# Altium schematic sheet LIDO-HW.300.VehicleInterface.SchDoc
size A3; SheetNumber: 14; SheetTotal: 17
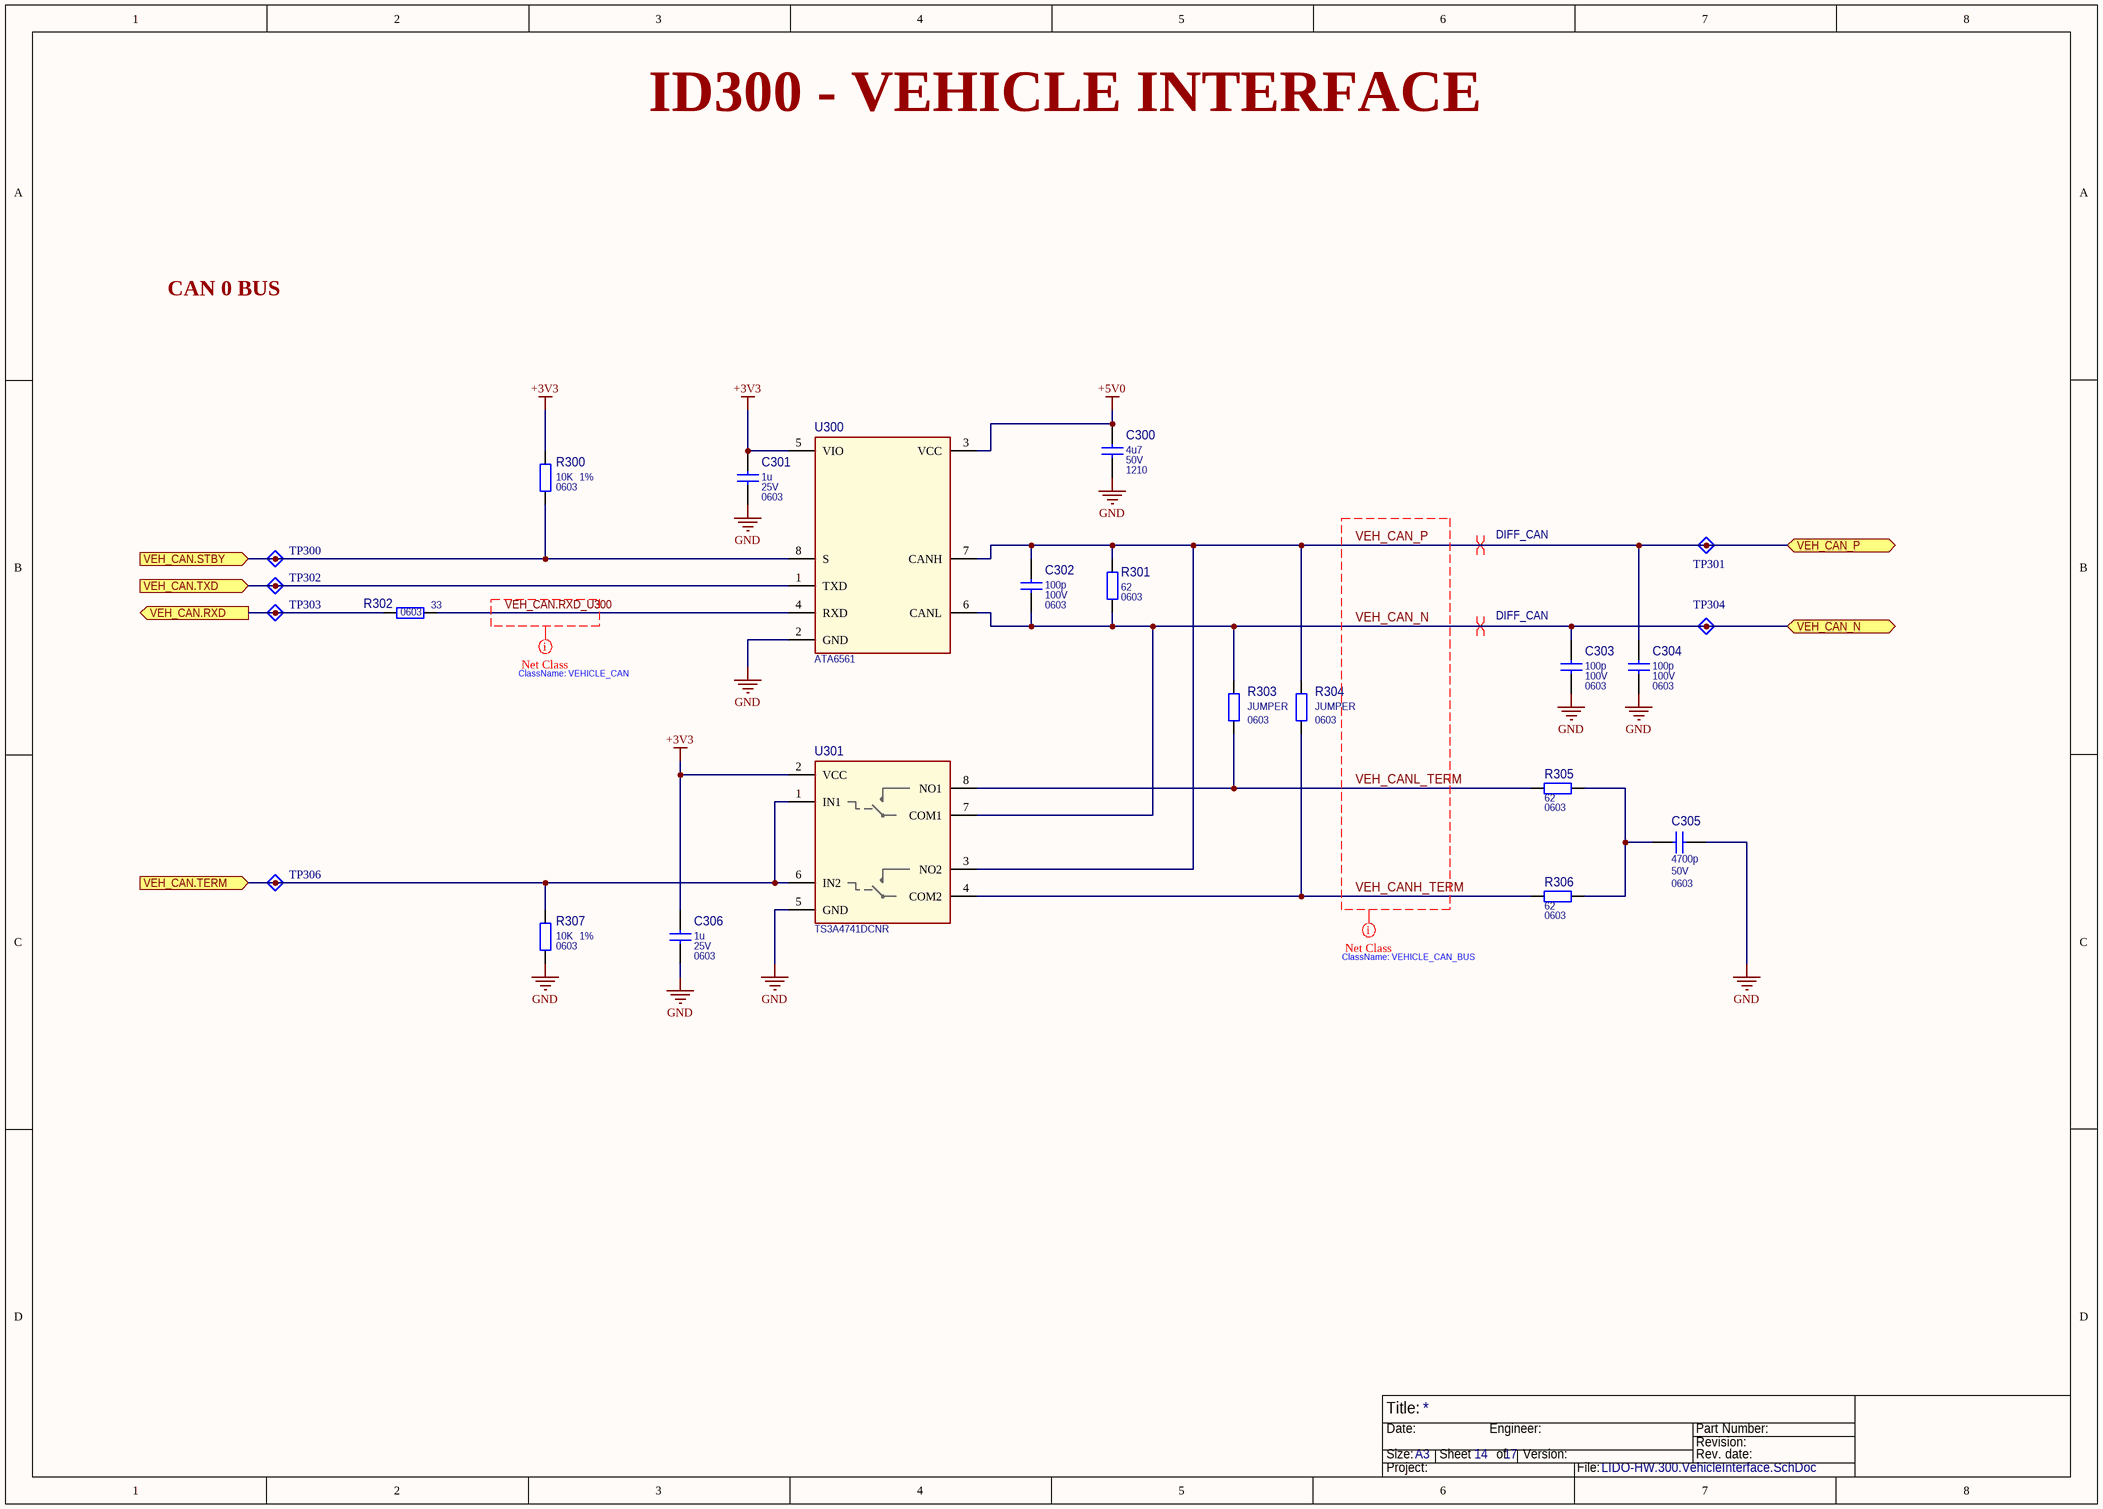
[diagram p0: LIDO-HW.300.VehicleInterface.SchDoc]

## Parts
C300  4u7  Part Value 2: 50V  Part Package: 1210  [CAP_1210_3225X180-N_MURATA_A]
C301  1u  Part Value 2: 25V  Part Package: 0603  [CAP_0603_1608X90-N_MURATA_A]
C302  100p  Part Value 2: 100V  Part Package: 0603  [CAP_0603_1608X90-N_MURATA_A]
C303  100p  Part Value 2: 100V  Part Package: 0603  [CAP_0603_1608X90-N_MURATA_A]
C304  100p  Part Value 2: 100V  Part Package: 0603  [CAP_0603_1608X90-N_MURATA_A]
C305  4700p  Part Value 2: 50V  Part Package: 0603  [CAP_0603_1608X90-N_MURATA_A]
C306  1u  Part Value 2: 25V  Part Package: 0603  [CAP_0603_1608X90-N_MURATA_A]
R300  10K  Part Value 2: 1%  Part Package: 0603  [RES_0603_1608X60-N_YAGEO_A]
R301  62  Part Package: 0603  [RES_0603_1608X60-N_YAGEO_A]
R302  33  Part Package: 0603  [RES_0603_1608X60-N_YAGEO_A]
R303  JUMPER  Part Package: 0603  [RES_0603_1608X60-N_YAGEO_A]
R304  JUMPER  Part Package: 0603  [RES_0603_1608X60-N_YAGEO_A]
R305  62  Part Package: 0603  [RES_0603_1608X60-N_YAGEO_A]
R306  62  Part Package: 0603  [RES_0603_1608X60-N_YAGEO_A]
R307  10K  Part Value 2: 1%  Part Package: 0603  [RES_0603_1608X60-N_YAGEO_A]
TP300  TestPoint_A  [TESTPOINT_1D_A]  (value not drawn)  (no BOM)
TP301  TestPoint_A  [TESTPOINT_1D_A]  (value not drawn)  (no BOM)
TP302  TestPoint_A  [TESTPOINT_1D_A]  (value not drawn)  (no BOM)
TP303  TestPoint_A  [TESTPOINT_1D_A]  (value not drawn)  (no BOM)
TP304  TestPoint_A  [TESTPOINT_1D_A]  (value not drawn)  (no BOM)
TP306  TestPoint_A  [TESTPOINT_1D_A]  (value not drawn)  (no BOM)
U300  ATA6561  [SOIC8P127_490X600X175L84X41-N_TI_A]
U301  TS3A4741DCNR  [SOT23-8P65_280X145L45-N_TI_A]

## Ports
VEH_CAN.RXD (out), VEH_CAN.STBY (in), VEH_CAN.TERM (in), VEH_CAN.TXD (in), VEH_CAN_N (bidir), VEH_CAN_P (bidir)

## Nets
+3V3: C301.1 C306.1 R300.2 U300.5(VIO) U301.2(VCC)
+5V0: C300.1 U300.3(VCC)
GND: C300.2 C301.2 C303.2 C304.2 C305.2 C306.2 R307.1 U300.2(GND) U301.5(GND)
VEH_CAN.RXD: R302.1 TP303.1(TP) ; port VEH_CAN.RXD
VEH_CAN.RXD_U300: R302.2 U300.4(RXD)
VEH_CAN.STBY: R300.1 TP300.1(TP) U300.8(S) ; port VEH_CAN.STBY
VEH_CAN.TERM: R307.2 TP306.1(TP) U301.1(IN1) U301.6(IN2) ; port VEH_CAN.TERM
VEH_CAN.TXD: TP302.1(TP) U300.1(TXD) ; port VEH_CAN.TXD
VEH_CAN_N: C302.2 C303.1 R301.1 R303.2 TP304.1(TP) U300.6(CANL) U301.7(COM1) ; port VEH_CAN_N
VEH_CAN_P: C302.1 C304.1 R301.2 R304.2 TP301.1(TP) U300.7(CANH) U301.3(NO2) ; port VEH_CAN_P
VEH_CANH_TERM: R304.1 R306.1 U301.4(COM2)
VEH_CANL_TERM: R303.1 R305.1 U301.8(NO1)
NetC305_1: C305.1 R305.2 R306.2

## Layout directives
net class VEHICLE_CAN: VEH_CAN.RXD_U300
net class VEHICLE_CAN_BUS: VEH_CAN_N, VEH_CAN_P, VEH_CANH_TERM, VEH_CANL_TERM
differential pair; differential pair class DIFF_CAN: VEH_CAN_N, VEH_CAN_P

## Notes on the sheet
- ID300 - VEHICLE INTERFACE
- CAN 0 BUS
- ClassName: VEHICLE_CAN
- ClassName: VEHICLE_CAN_BUS
- Title:
- Size:
- Date:
- A3
- Sheet       of
- Engineer:
- Version:
- Part Number:
- Revision:
- Rev. date:
- Project:
- File:

## Library data of the parts
C300 = 91: CAP CER 4.7UF 50V X7R 1210; Manufacturer Part Number: CL32B475KBJVPNE; Manufacturer: Samsung Electro-Mechanics; Obsolete Part: False; Component ID: 91; Part Value: 4u7; Part Value 3: X7R; Package Type: SMT
C301 C306 = 78: CAP CER 1UF 25V X7R 0603; Manufacturer Part Number: CGA3E1X7R1E105M080AE; Manufacturer: TDK Corporation; Obsolete Part: False; Component ID: 78; Part Value: 1u; Part Value 3: X7R; Package Type: SMT
C302-C304 = 75: CAP CER 100PF 100V C0G 0603; Manufacturer Part Number: CGA3E2C0G2A101J080AA; Manufacturer: TDK Corporation; Obsolete Part: False; Component ID: 75; Part Value: 100p; Part Value 3: 5%; Package Type: SMT
C305 = 85: CAP CER 4700PF 50V X7R 0603; Manufacturer Part Number: CGA3E2X7R1H472K080AA; Manufacturer: TDK Corporation; Obsolete Part: False; Component ID: 85; Part Value: 4700p; Part Value 3: X7R; Package Type: SMT
R300 R307 = 115: RES 10K OHM 1% 1/10W 0603; Manufacturer Part Number: RC0603FR-0710KL; Manufacturer: YAGEO; Obsolete Part: False; Component ID: 115; Part Value: 10K; Part Value 3: 1/10W; Package Type: SMT
R301 R305 R306 = 116: RES SMD 62 OHM 1% 1/10W 0603; Manufacturer Part Number: ERJ-3EKF62R0V; Manufacturer: Panasonic Electronic Components; Obsolete Part: False; Component ID: 116; Part Value: 62; Part Value 2: 1%; Part Value 3: 1/10W; Package Type: SMT
R302 = 121: RES 33 OHM 5% 1/10W 0603; Manufacturer Part Number: RC0603JR-0733RL; Manufacturer: YAGEO; Obsolete Part: False; Component ID: 121; Part Value: 33; Part Value 2: 5%; Part Value 3: 1/10W; Package Type: SMT
R303 R304 = 9: RES 0 OHM JUMPER 1/10W 0603; Manufacturer Part Number: RC0603JR-070RL; Manufacturer: YAGEO; Manufacturer Part Number 2nd: RMCF0603ZT0R00; Manufacturer 2nd: Stackpole Electronics Inc; Obsolete Part: False; Component ID: 9; Part Value: JUMPER; Part Value 2: 5%; Part Value 3: 1/10W; Package Type: SMT
TP300-TP304 TP306 = 3: Pad Diamater 1mm; Part: Test Point 1D A; Obsolete Part: False; 00_Name: TP_XXmm; Component ID: 3; 02_Layer: *; 01_Diameter: 1mm
U300 = 4: IC TRANSCEIVER 1/1 8SO; Manufacturer: Microchip Technology; Manufacturer Part Number: ATA6561-GAQW; Part Package: SOIC-8; Obsolete Part: False; Designer: Matt Drazenovich; Ratings: RoHS; Reviewed: Dekimo_07-07-2020; Component ID: 4; Case/Package: 8-SOIC; ComponentType: IC; Design Date: 22-11-2019; Max Operating Temperature: 150°C; Min Operating Temperature: -40°C; Value: ATA6561; Part Type: TRANSCEIVER; Package Type: SMT
U301 = 5: IC SWITCH DUAL SPST SOT23-8; Manufacturer: Texas Instruments; Obsolete Part: False; Designer: Matt Drazenovich; Ratings: RoHS; Reviewed: Not Footprint; Component ID: 5; Case/Package: SOT-23-8; ComponentType: IC; Design Date: 09-09-2021; Manufacturer Part Number: TS3A4741DCNR; Max Operating Temperature: 85°C; Min Operating Temperature: -40°C; Value: TS3A4741DCNR; Part Type: ANALOG SWITCH; Part Package: SOT23-8; Package Type: SMT